# Altium project LimePSB-RPCM_1v3.PrjPcb (part 7 of 14)

## Sheet 10_USB_HDMI.SchDoc: USB and HDMI sockets
size A3; Organization: Lime Microsystems; Address1: Surrey Tech Centre; Address2: Guildford GU2 7YG; Address3: Surrey; Address4: United Kingdom; Revision: v1.3; SheetNumber: 10; SheetTotal: 15
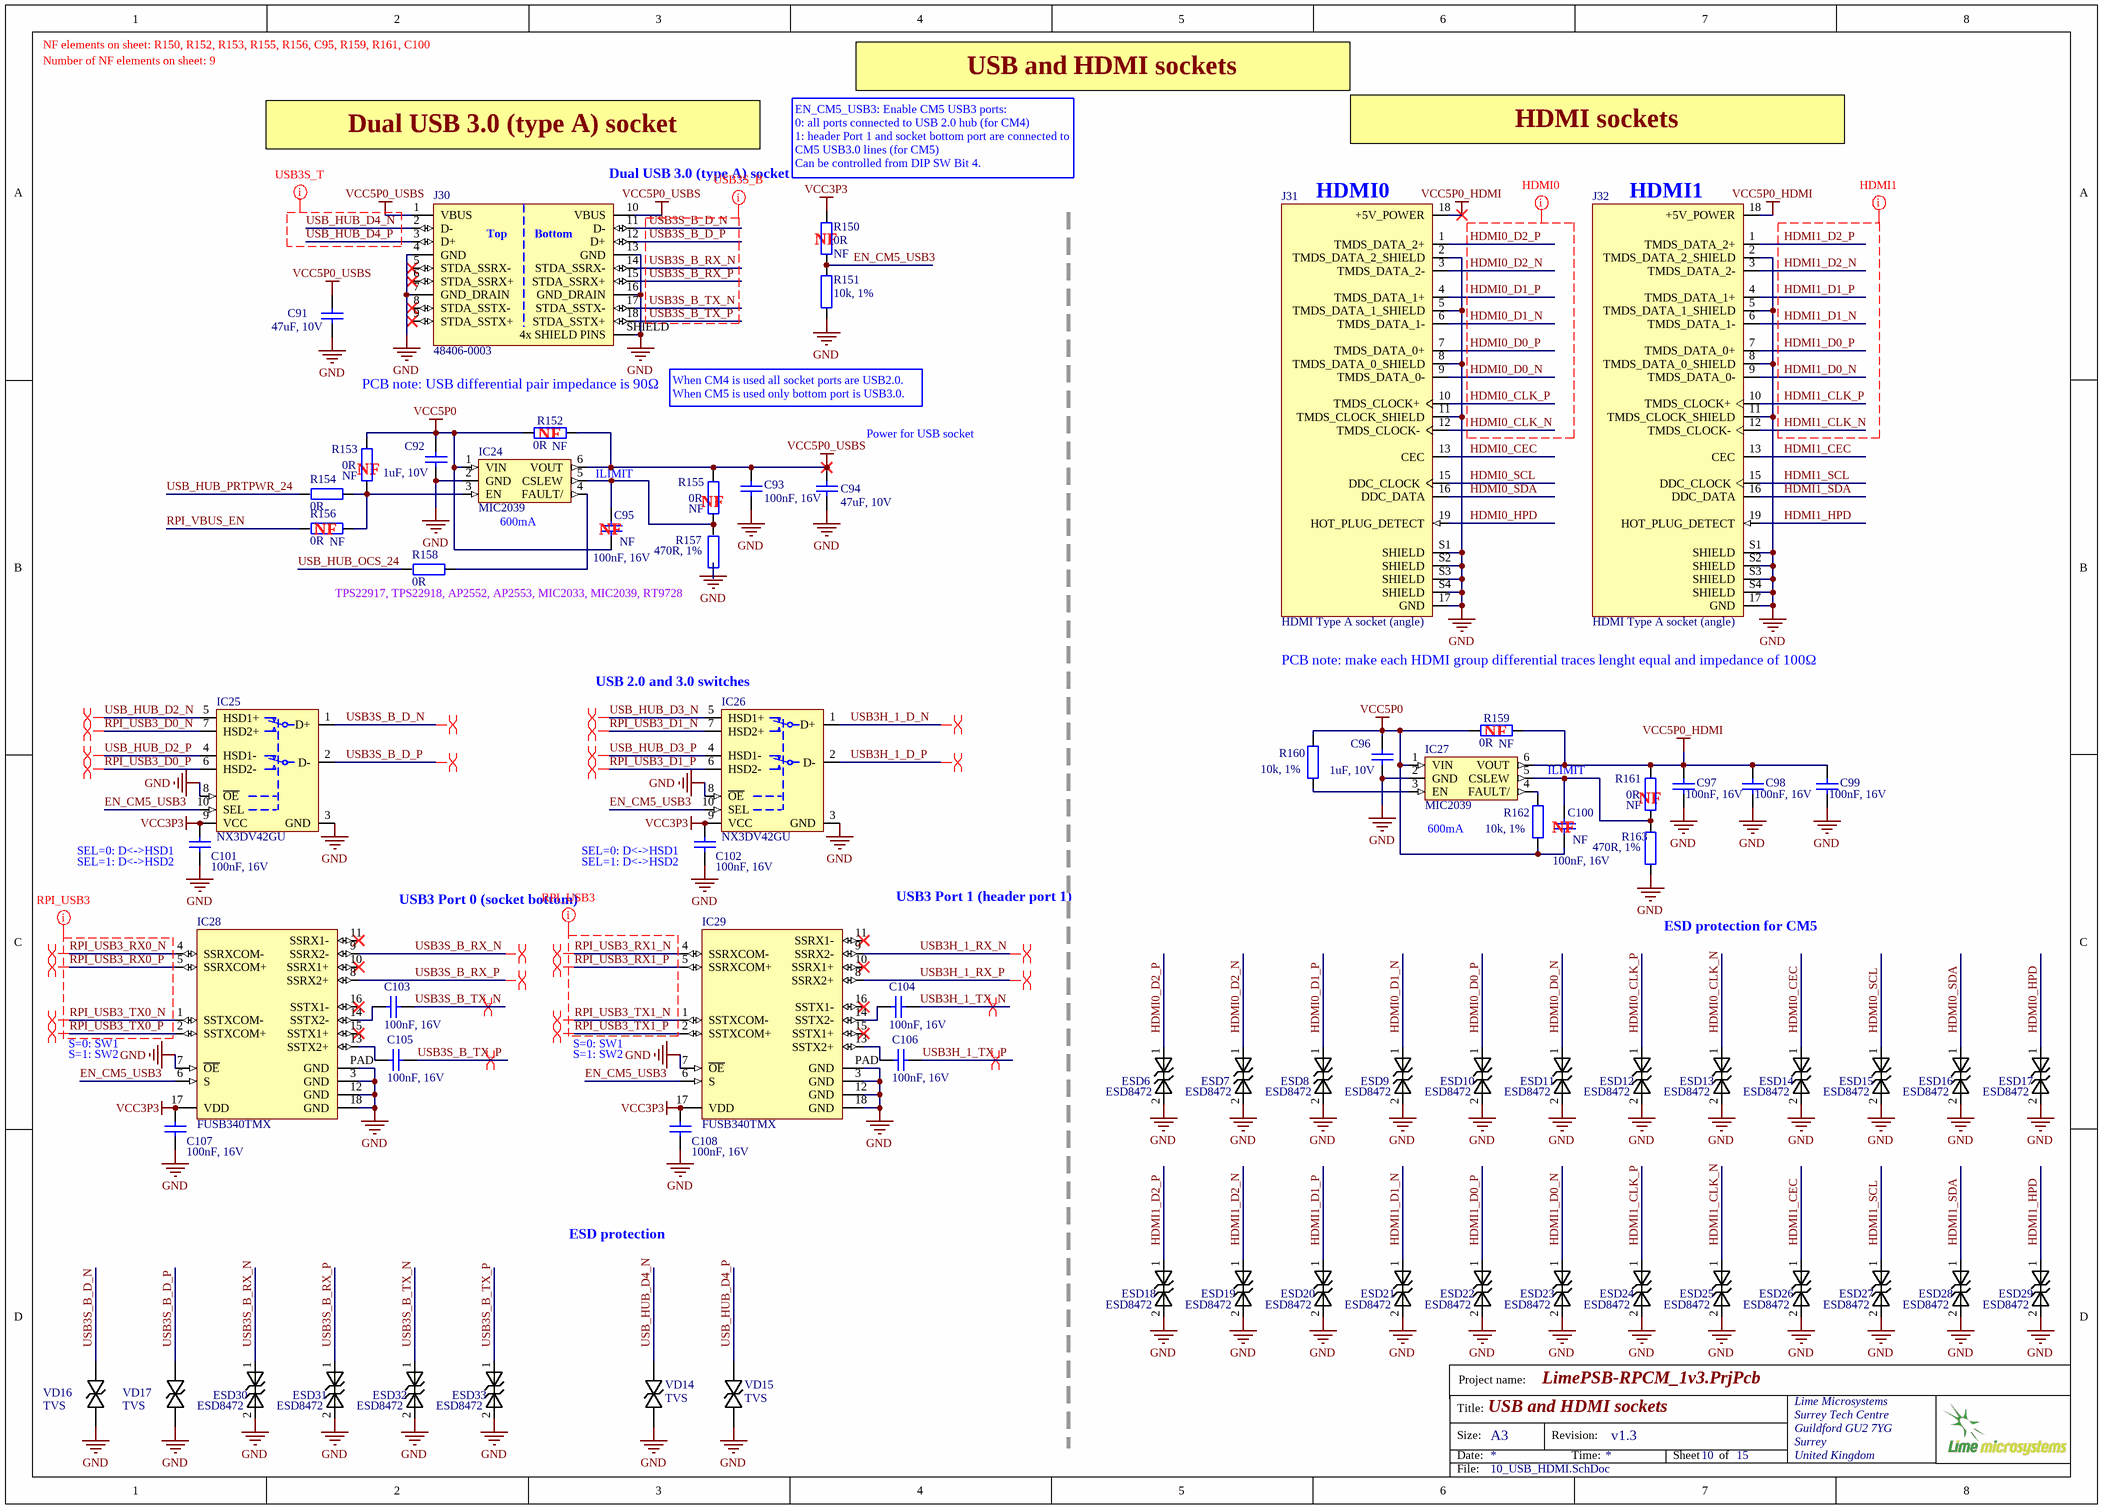
[diagram p9: 10_USB_HDMI.SchDoc]

### Parts
C91  47uF, 10V  [CAP1206]
C92  1uF, 10V  [CAP0402]
C93  100nF, 16V  [CAP0402]
C94  47uF, 10V  [CAP1206]
C95  100nF, 16V  Assembly Info: NF  [CAP0402]
C96  1uF, 10V  [CAP0402]
C97  100nF, 16V  [CAP0402]
C98  100nF, 16V  [CAP0402]
C99  100nF, 16V  [CAP0402]
C100  100nF, 16V  Assembly Info: NF  [CAP0402]
C101  100nF, 16V  [CAP0402]
C102  100nF, 16V  [CAP0402]
C103  100nF, 16V  [CAP0402]
C104  100nF, 16V  [CAP0402]
C105  100nF, 16V  [CAP0402]
C106  100nF, 16V  [CAP0402]
C107  100nF, 16V  [CAP0402]
C108  100nF, 16V  [CAP0402]
ESD6  ESD8472  [ESD8472_X3DFN2]
ESD7  ESD8472  [ESD8472_X3DFN2]
ESD8  ESD8472  [ESD8472_X3DFN2]
ESD9  ESD8472  [ESD8472_X3DFN2]
ESD10  ESD8472  [ESD8472_X3DFN2]
ESD11  ESD8472  [ESD8472_X3DFN2]
ESD12  ESD8472  [ESD8472_X3DFN2]
ESD13  ESD8472  [ESD8472_X3DFN2]
ESD14  ESD8472  [ESD8472_X3DFN2]
ESD15  ESD8472  [ESD8472_X3DFN2]
ESD16  ESD8472  [ESD8472_X3DFN2]
ESD17  ESD8472  [ESD8472_X3DFN2]
ESD18  ESD8472  [ESD8472_X3DFN2]
ESD19  ESD8472  [ESD8472_X3DFN2]
ESD20  ESD8472  [ESD8472_X3DFN2]
ESD21  ESD8472  [ESD8472_X3DFN2]
ESD22  ESD8472  [ESD8472_X3DFN2]
ESD23  ESD8472  [ESD8472_X3DFN2]
ESD24  ESD8472  [ESD8472_X3DFN2]
ESD25  ESD8472  [ESD8472_X3DFN2]
ESD26  ESD8472  [ESD8472_X3DFN2]
ESD27  ESD8472  [ESD8472_X3DFN2]
ESD28  ESD8472  [ESD8472_X3DFN2]
ESD29  ESD8472  [ESD8472_X3DFN2]
ESD30  ESD8472  [ESD8472_X3DFN2]
ESD31  ESD8472  [ESD8472_X3DFN2]
ESD32  ESD8472  [ESD8472_X3DFN2]
ESD33  ESD8472  [ESD8472_X3DFN2]
IC24  MIC2039  [SOT23-6]
IC25  NX3DV42GU  [FSUSB42UMX]
IC26  NX3DV42GU  [FSUSB42UMX]
IC27  MIC2039  [SOT23-6]
IC28  FUSB340TMX  [FUSB340TMX_USB_switch_18-XFQFN]
IC29  FUSB340TMX  [FUSB340TMX_USB_switch_18-XFQFN]
J30  48406-0003  [Dual_USB_48406-0003_Molex]
J31  HDMI Type A socket (angle)  [HDMI_HD01-19-RA-TH]
J32  HDMI Type A socket (angle)  [HDMI_HD01-19-RA-TH]
R150  0R  Assembly Info: NF  [RES0402]
R151  10k, 1%  [RES0402]
R152  0R  Assembly Info: NF  [RES0402]
R153  0R  Assembly Info: NF  [RES0402]
R154  0R  [RES0402]
R155  0R  Assembly Info: NF  [RES0402]
R156  0R  Assembly Info: NF  [RES0402]
R157  470R, 1%  [RES0402]
R158  0R  [RES0402]
R159  0R  Assembly Info: NF  [RES0402]
R160  10k, 1%  [RES0402]
R161  0R  Assembly Info: NF  [RES0402]
R162  10k, 1%  [RES0402]
R163  470R, 1%  [RES0402]
VD14  TVS  [SOD323]
VD15  TVS  [SOD323]
VD16  TVS  [SOD323]
VD17  TVS  [SOD323]

### Nets
GND: C91.1 C92.2 C93.2 C94.1 C96.2 C97.2 C98.2 C99.2 C101.2 C102.2 C107.2 C108.2 ESD6.2 ESD7.2 ESD8.2 ESD9.2 ESD10.2 ESD11.2 ESD12.2 ESD13.2 ESD14.2 ESD15.2 ESD16.2 ESD17.2 ESD18.2 ESD19.2 ESD20.2 ESD21.2 ESD22.2 ESD23.2 ESD24.2 ESD25.2 ESD26.2 ESD27.2 ESD28.2 ESD29.2 ESD30.2 ESD31.2 ESD32.2 ESD33.2 IC24.2(GND) IC25.3(GND) IC25.8(~{OE}) IC26.3(GND) IC26.8(~{OE}) IC27.2(GND) IC28.3(GND) IC28.7(~{OE}) IC28.12(GND) IC28.18(GND) IC28.PAD(GND) IC29.3(GND) IC29.7(~{OE}) IC29.12(GND) IC29.18(GND) IC29.PAD(GND) J30.4(GND) J30.7(GND_DRAIN) J30.13(GND) J30.16(GND_DRAIN) J30.SHIELD(4x_SHIELD_PINS) J31.2(TMDS_DATA_2_SHIELD) J31.5(TMDS_DATA_1_SHIELD) J31.8(TMDS_DATA_0_SHIELD) J31.11(TMDS_CLOCK_SHIELD) J31.17(GND) J31.S1(SHIELD) J31.S2(SHIELD) J31.S3(SHIELD) J31.S4(SHIELD) J32.2(TMDS_DATA_2_SHIELD) J32.5(TMDS_DATA_1_SHIELD) J32.8(TMDS_DATA_0_SHIELD) J32.11(TMDS_CLOCK_SHIELD) J32.17(GND) J32.S1(SHIELD) J32.S2(SHIELD) J32.S3(SHIELD) J32.S4(SHIELD) R151.2 R157.1 R163.1 VD14.K VD15.K VD16.K VD17.K
VCC3P3: C101.1 C102.1 C107.1 C108.1 IC25.9(VCC) IC26.9(VCC) IC28.17(VDD) IC29.17(VDD) R150.2
VCC5P0: C92.1 C95.2 C96.1 C100.2 IC24.1(VIN) IC27.1(VIN) R152.2 R153.2 R159.2 R160.2 R162.1
VCC5P0_HDMI: C97.1 C98.1 C99.1 IC27.6(VOUT) J31.18(+5V_POWER) J32.18(+5V_POWER) R159.1 R161.2
VCC5P0_USBS: C91.2 C93.1 C94.2 IC24.6(VOUT) J30.1(VBUS) J30.10(VBUS) R152.1 R155.2
EN_CM5_USB3: IC25.10(SEL) IC26.10(SEL) IC28.6(S) IC29.6(S) R150.1 R151.1
HDMI0_CEC: ESD14.1 J31.13(CEC)
HDMI0_CLK_N: ESD13.1 J31.12(TMDS_CLOCK-)
HDMI0_CLK_P: ESD12.1 J31.10(TMDS_CLOCK+)
HDMI0_D0_N: ESD11.1 J31.9(TMDS_DATA_0-)
HDMI0_D0_P: ESD10.1 J31.7(TMDS_DATA_0+)
HDMI0_D1_N: ESD9.1 J31.6(TMDS_DATA_1-)
HDMI0_D1_P: ESD8.1 J31.4(TMDS_DATA_1+)
HDMI0_D2_N: ESD7.1 J31.3(TMDS_DATA_2-)
HDMI0_D2_P: ESD6.1 J31.1(TMDS_DATA_2+)
HDMI0_HPD: ESD17.1 J31.19(HOT_PLUG_DETECT)
HDMI0_SCL: ESD15.1 J31.15(DDC_CLOCK)
HDMI0_SDA: ESD16.1 J31.16(DDC_DATA)
HDMI1_CEC: ESD26.1 J32.13(CEC)
HDMI1_CLK_N: ESD25.1 J32.12(TMDS_CLOCK-)
HDMI1_CLK_P: ESD24.1 J32.10(TMDS_CLOCK+)
HDMI1_D0_N: ESD23.1 J32.9(TMDS_DATA_0-)
HDMI1_D0_P: ESD22.1 J32.7(TMDS_DATA_0+)
HDMI1_D1_N: ESD21.1 J32.6(TMDS_DATA_1-)
HDMI1_D1_P: ESD20.1 J32.4(TMDS_DATA_1+)
HDMI1_D2_N: ESD19.1 J32.3(TMDS_DATA_2-)
HDMI1_D2_P: ESD18.1 J32.1(TMDS_DATA_2+)
HDMI1_HPD: ESD29.1 J32.19(HOT_PLUG_DETECT)
HDMI1_SCL: ESD27.1 J32.15(DDC_CLOCK)
HDMI1_SDA: ESD28.1 J32.16(DDC_DATA)
RPI_USB3_D0_N: IC25.7(HSD2+)
RPI_USB3_D0_P: IC25.6(HSD2-)
RPI_USB3_D1_N: IC26.7(HSD2+)
RPI_USB3_D1_P: IC26.6(HSD2-)
RPI_USB3_RX0_N: IC28.4(SSRXCOM-)
RPI_USB3_RX0_P: IC28.5(SSRXCOM+)
RPI_USB3_RX1_N: IC29.4(SSRXCOM-)
RPI_USB3_RX1_P: IC29.5(SSRXCOM+)
RPI_USB3_TX0_N: IC28.1(SSTXCOM-)
RPI_USB3_TX0_P: IC28.2(SSTXCOM+)
RPI_USB3_TX1_N: IC29.1(SSTXCOM-)
RPI_USB3_TX1_P: IC29.2(SSTXCOM+)
RPI_VBUS_EN: R156.2
USB3H_1_D_N: IC26.1(D+)
USB3H_1_D_P: IC26.2(D-)
USB3H_1_RX_N: IC29.9(SSRX2-)
USB3H_1_RX_P: IC29.8(SSRX2+)
USB3H_1_TX_N: C104.2
USB3H_1_TX_P: C106.2
USB3S_B_D_N: IC25.1(D+) J30.11(D-) VD16.A
USB3S_B_D_P: IC25.2(D-) J30.12(D+) VD17.A
USB3S_B_RX_N: ESD30.1 IC28.9(SSRX2-) J30.14(STDA_SSRX-)
USB3S_B_RX_P: ESD31.1 IC28.8(SSRX2+) J30.15(STDA_SSRX+)
USB3S_B_TX_N: C103.2 ESD32.1 J30.17(STDA_SSTX-)
USB3S_B_TX_P: C105.2 ESD33.1 J30.18(STDA_SSTX+)
USB_HUB_D2_N: IC25.5(HSD1+)
USB_HUB_D2_P: IC25.4(HSD1-)
USB_HUB_D3_N: IC26.5(HSD1+)
USB_HUB_D3_P: IC26.4(HSD1-)
USB_HUB_D4_N: J30.2(D-) VD14.A
USB_HUB_D4_P: J30.3(D+) VD15.A
USB_HUB_OCS_24: R158.2
USB_HUB_PRTPWR_24: R154.2
NetC95_1: C95.1 IC24.5(CSLEW) R155.1 R157.2
NetC100_1: C100.1 IC27.5(CSLEW) R161.1 R163.2
NetC103_1: C103.1 IC28.14(SSTX2-)
NetC104_1: C104.1 IC29.14(SSTX2-)
NetC105_1: C105.1 IC28.13(SSTX2+)
NetC106_1: C106.1 IC29.13(SSTX2+)
NetIC24_3: IC24.3(EN) R153.1 R154.1 R156.1
NetIC24_4: IC24.4(FAULT/) R158.1
NetIC27_3: IC27.3(EN) R160.1
NetIC27_4: IC27.4(FAULT/) R162.2

Not connected (* = marked no-connect by the designer): IC28 10(SSRX1+)* 11(SSRX1-)* 15(SSTX1+)* 16(SSTX1-)*; IC29 10(SSRX1+)* 11(SSRX1-)* 15(SSTX1+)* 16(SSTX1-)*; J30 5(STDA_SSRX-)* 6(STDA_SSRX+)* 8(STDA_SSTX-)* 9(STDA_SSTX+)*

### Layout directives
differential pair: RPI_USB3_D0_N, RPI_USB3_D0_P, RPI_USB3_D1_N, RPI_USB3_D1_P, RPI_USB3_RX0_N, RPI_USB3_RX0_P, RPI_USB3_RX1_N, RPI_USB3_RX1_P, RPI_USB3_TX0_N, RPI_USB3_TX0_P, RPI_USB3_TX1_N, RPI_USB3_TX1_P, USB3H_1_D_N, USB3H_1_D_P, USB3H_1_RX_N, USB3H_1_RX_P, USB3H_1_TX_N, USB3H_1_TX_P, USB3S_B_D_N, USB3S_B_D_P, USB3S_B_RX_N, USB3S_B_RX_P, USB3S_B_TX_N, USB3S_B_TX_P, USB_HUB_D2_N, USB_HUB_D2_P, USB_HUB_D3_N, USB_HUB_D3_P
net class RPI_USB3: RPI_USB3_RX0_N, RPI_USB3_RX0_P, RPI_USB3_RX1_N, RPI_USB3_RX1_P, RPI_USB3_TX0_N, RPI_USB3_TX0_P, RPI_USB3_TX1_N, RPI_USB3_TX1_P
net class HDMI0: HDMI0_CLK_N, HDMI0_CLK_P, HDMI0_D0_N, HDMI0_D0_P, HDMI0_D1_N, HDMI0_D1_P, HDMI0_D2_N, HDMI0_D2_P
net class HDMI1: HDMI1_CLK_N, HDMI1_CLK_P, HDMI1_D0_N, HDMI1_D0_P, HDMI1_D1_N, HDMI1_D1_P, HDMI1_D2_N, HDMI1_D2_P
net class USB3S_T: USB_HUB_D4_N, USB_HUB_D4_P, VCC5P0_USBS
net class USB3S_B: USB3S_B_D_N, USB3S_B_D_P, USB3S_B_RX_N, USB3S_B_RX_P, USB3S_B_TX_N, USB3S_B_TX_P

### Notes on the sheet
- Number of NF elements on sheet: 9
- NF elements on sheet: R150, R152, R153, R155, R156, C95, R159, R161, C100
- USB and HDMI sockets
- Dual USB 3.0 (type A) socket
- (near J30) Dual USB 3.0 (type A) socket
- (near R150) EN_CM5_USB3: Enable CM5 USB3 ports:
  0: all ports connected to USB 2.0 hub (for CM4)
  1: header Port 1 and socket bottom port are connected to CM5 USB3.0 lines (for CM5)
  Can be controlled from DIP SW Bit 4.
- HDMI sockets
- (near R150) NF
- HDMI0
- HDMI1
- PCB note: USB differential pair impedance is 90Ω
- (near R152) NF
- When CM4 is used all socket ports are USB2.0.
  When CM5 is used only bottom port is USB3.0.
- Power for USB socket
- (near R153) NF
- ILIMIT
- (near R155) NF
- (near R156) NF
- (near IC24) 600mA
- (near C95) NF
- TPS22917, TPS22918, AP2552, AP2553, MIC2033, MIC2039, RT9728
- USB 2.0 and 3.0 switches
- PCB note: make each HDMI group differential traces lenght equal and impedance of 100Ω
- (near R159) NF
- (near C101) SEL=0: D<->HSD1
- (near C102) SEL=0: D<->HSD1
- (near IC27) 600mA
- NF
- (near R161) NF
- (near C101) SEL=1: D<->HSD2
- USB3 Port 0 (socket bottom)
- (near C102) SEL=1: D<->HSD2
- USB3 Port 1 (header port 1)
- ESD protection for CM5
- S=0: SW1
- S=1: SW2
- ESD protection
- Project name:
- Title:
- Size:
- Date:
- A3
- Revision:
- Time:
- Sheet
- of
- File:

### Library data of the parts
C91 C94 = Cap_1206: Manufacturer: TDK Corporation; Manufacturer Part Number 1: C3216X6S1A476M160AC; Part Description: 47µF ±20% 10V Ceramic Capacitor X6S 1206 (3216 Metric); Notification: Current market demand for these product types have resulted in fluctuating and extending lead times. Lead times may differ.; Tolerance: ±20%; Temperature Coefficient: X6S; Value: 47uF, 10V; RoHS: RoHS Compliant; Packaging: Cut Tape (CT); Operating Temperature: -55°C ~ 105°C; Voltage - Rated: 10V; Height - Seated (Max): -; Ratings: -; Applications: General Purpose; Features: Low ESL; Size / Dimension: 0.126" L x 0.063" W (3.20mm x 1.60mm); Supplier 1: Digi-Key; Lead Spacing: -; Supplier Part Number 1: 445-6010-1-ND; Thickness (Max): 0.071" (1.80mm); Failure Rate: -; Category: Capacitors; Lead Style: -; Part Status: Active; Mounting Type: Surface Mount, MLCC; Package / Case: 1206 (3216 Metric)
C92 C96 = Cap_0402: Manufacturer Part Number 1: CC0402MRX5R6BB105; Manufacturer: Yageo; Part Description: 1µF 10V Ceramic Capacitor X5R 0402 (1005 Metric) 0.039" L x 0.020" W (1.00mm x 0.50mm); Voltage Rating: 10; Capacitance Tolerance: ± 10%; Product Range: TDK - C Series; Ceramic Capacitor Case: 0402 [1005 Metric]; Capacitance: 1; Dielectric Characteristic: X6; Value: 1uF, 10V; Supplier 1: Digi-Key; Supplier Part Number 1: 311-1732-1-ND; MSL: -; RoHS: YES
C93 C95 C97-C100 = Cap_0402: Manufacturer: Murata Electronics; Manufacturer Part Number 1: GRM155R71C104KA88D; Part Description: 0.10µF ±10% 16V Ceramic Capacitor X7R 0402 (1005 Metric); Tolerance: 10 %; Type: General Purpose MLCC; Capacitance: 0.1 uF; Case Length: 1 mm; Dielectric: X7R; Case Height: 0.5 mm; Temperature Coefficient / Code: +/- 15 %; Value: 100nF, 16V; Supplier 1: Mouser; Supplier Part Number 1: 81-GRM155R71C104KA88; Case Code - in: 0402; RoHS: RoHS Compliant; Operating Temperature Range: - 55 C to + 125 C; Series: GRM; Termination Style: SMD/SMT; Package / Case: 0402 (1005 metric); Voltage Rating DC: 16 V; Maximum Operating Temperature: + 125 C; Case Code - mm: 1005; Minimum Operating Temperature: - 55 C; Product Category: Low & Medium Capacitance SMD Ceramic Chip Capacitors; Packaging: Reel; Product: General Type MLCCs; Category: Multilayer Ceramic Capacitors MLCC - SMD/SMT; Brand: Murata Electronics; Case Width: 0.5 mm; RoHS - Mouser: Y; Standard Pack Qty: 10000; Minimum Order Quantity: 1; Reeling: True; Manufacturer Part Number: GRM155R71C104KA88D
C101-C108 = Cap_0402: Manufacturer: Murata Electronics; Manufacturer Part Number: GRM155R71C104KA88D; Part Description: 0.10µF ±10% 16V Ceramic Capacitor X7R 0402 (1005 Metric); Tolerance: 10 %; Type: General Purpose MLCC; Capacitance: 0.1 uF; Case Length: 1 mm; Dielectric: X7R; Case Height: 0.5 mm; Temperature Coefficient / Code: +/- 15 %; Value: 100nF, 16V; Supplier 1: Mouser; Supplier Part Number 1: 81-GRM155R71C104KA88; Case Code - in: 0402; RoHS: RoHS Compliant; Operating Temperature Range: - 55 C to + 125 C; Series: GRM; Termination Style: SMD/SMT; Package / Case: 0402 (1005 metric); Voltage Rating DC: 16 V; Maximum Operating Temperature: + 125 C; Case Code - mm: 1005; Minimum Operating Temperature: - 55 C; Product Category: Low & Medium Capacitance SMD Ceramic Chip Capacitors; Packaging: Reel; Product: General Type MLCCs; Category: Multilayer Ceramic Capacitors MLCC - SMD/SMT; Brand: Murata Electronics; Case Width: 0.5 mm; RoHS - Mouser: Y; Standard Pack Qty: 10000; Minimum Order Quantity: 1; Reeling: True; Manufacturer Part Number 1: GRM155R71C104KA88D
ESD6-ESD33 = ESD8472: Manufacturer: ON Semiconductor; Manufacturer Part Number 1: ESD8472MUT5G; Part Description: TVS DIODE 5.3VWM 14VC X3DFN2; Voltage - Reverse Standoff (Typ): 5.3V (Max); Voltage - Breakdown (Min): 7V; Voltage - Clamping (Max) @ Ipp: 14V; Current - Peak Pulse (10/1000µs): 3A (8/20µs); Power Line Protection: No; Capacitance @ Frequency: 0.2pF @ 1MHz; Supplier 1: Digi-Key; RoHS: RoHS Compliant; Category: Circuit Protection; Stock 1: 2295; Pricing 1: 1=0.39, 10=0.315, 100=0.2142, 500=0.16068, 1000=0.12051 (USD); Packaging: Cut Tape (CT); Part Status: Active; Type: Zener; Power - Peak Pulse: -; Applications: Automotive, RF Antenna; Operating Temperature: -55°C ~ 150°C (TJ); Mounting Type: Surface Mount; Package / Case: 2-XFDFN; Supplier Device Package: 2-X3DFN (0.62x0.32); ComponentLink1URL: http://www.onsemi.com/pub/Collateral/ESD8472-D.PDF; ComponentLink1Description: http://www.onsemi.com/pub/Collateral/ESD8472-D.PDF; Supplier Part Number 1: ESD8472MUT5GOSCT-ND
IC24 IC27 = MIC2033_power_switch: Part Description: Power Switch/Driver 1:1 P-Channel 2.5A SOT-23-6; Manufacturer: Microchip; Manufacturer Part Number 1: MIC2039EYM6-TR; Number of Outputs: 1; Interface: On/Off; Max Output Current: 2.5A; Fault Protection: Over Temperature; Output Configuration: High Side; ComponentLink1URL: http://www.mouser.com/ds/2/268/mic2033-b-1076865.pdf?src-supplier=Mouser; ComponentLink1Description: http://www.mouser.com/ds/2/268/mic2033-b-1076865.pdf?src-supplier=Mouser; ComponentLink2URL: http://components.arrow.com/part/dataview/56727820S413982N1374?src-supplier=Arrow+Electronics; ComponentLink2Description: http://components.arrow.com/part/dataview/56727820S413982N1374?src-supplier=Arrow+Electronics; ComponentLink3URL: http://www.microchip.com/mymicrochip/filehandler.aspx?ddocname=en579457&src-supplier=Digi-Key; ComponentLink3Description: http://www.microchip.com/mymicrochip/filehandler.aspx?ddocname=en579457&src-supplier=Digi-Key; Supplier 1: Digi-Key; Supplier Part Number 1: 576-4193-1-ND; Stock 1: 37195; Pricing 1: 1=0,98000, 25=0,80560, 100=0,75000 (USD); RoHS: No; Case/Package: SOT-23-6; Min Operating Temperature: -40°C; Max Operating Temperature: 125°C; Package Quantity: 3000; Packaging: Tape and Reel; Series: -; ComponentLink4URL: https://datasheet.ciiva.com/6607/mic2039-6607725.pdf?src-supplier=Digi-Key; ComponentLink4Description: https://datasheet.ciiva.com/6607/mic2039-6607725.pdf?src-supplier=Digi-Key
IC25 IC26 = FSUSB42UMX: Part Description: USB Switch IC 1 Channel 10-UMLP (1.8x1.4); Manufacturer: NXP Semiconductors; Manufacturer Part Number 1: NX3DV42GU,115; ComponentLink1URL: https://www.fairchildsemi.com/datasheets/FS/FSUSB42.pdf; ComponentLink1Description: https://www.fairchildsemi.com/datasheets/FS/FSUSB42.pdf; Supplier 1: Digikey; Supplier Part Number 1: 568-12388-1-ND; Stock 1: 3109; Pricing 1: 1=0,89, 10=0,781, 25=0,7336, 100=0,5987, 250=0,55612, 500=0,47328, 1000=0,37863 (USD); RoHS: Yes; ComponentLink2URL: http://www.mouser.com/ds/2/302/NX3DV42-1127466.pdf?src-supplier=Mouser; ComponentLink2Description: http://www.mouser.com/ds/2/302/NX3DV42-1127466.pdf?src-supplier=Mouser; ComponentLink3URL: http://www.nxp.com/documents/data_sheet/NX3DV42.pdf?src-supplier=Avnet; ComponentLink3Description: http://www.nxp.com/documents/data_sheet/NX3DV42.pdf?src-supplier=Avnet; ComponentLink4URL: http://www.nxp.com/documents/data_sheet/NX3DV42.pdf?src-supplier=Digikey; ComponentLink4Description: http://www.nxp.com/documents/data_sheet/NX3DV42.pdf?src-supplier=Digikey; ComponentLink5URL: https://www.nxp.com/docs/en/data-sheet/NX3DV42.pdf?src-supplier=Digikey; ComponentLink5Description: https://www.nxp.com/docs/en/data-sheet/NX3DV42.pdf?src-supplier=Digikey
IC28 IC29 = FUSB340TMX_USB_switch: Part Description: USB Switch USB 3.1 USB Interface 18-TMLP (2x2.8); Manufacturer: ON Semiconductor / Fairchild; Interface: USB; Operating Supply Current: 12uA; Number of Switches: 4; Data Rate: 10Gbps; Max Supply Voltage: 5V; Min Supply Voltage: 1.5V; Supplier 1: Digikey; Supplier Part Number 1: FUSB340TMXCT-ND; Manufacturer Part Number 1: FUSB340TMX; Stock 1: 7942; Pricing 1: 1=1,15, 10=1,026, 25=0,9744, 100=0,7481, 250=0,66108, 500=0,6263, 1000=0,48712, 2500=0,46277 (USD); RoHS: Yes; Mount: Surface Mount; Number of Pins: 18; Weight: 0.0065g; Min Operating Temperature: -40°C; Max Operating Temperature: 85°C; Packaging: Cut Tape; Series: -; Nominal Supply Current: 12uA; Height: 400um; RoHS Compliant: Yes; ComponentLink1URL: http://www.farnell.com/datasheets/2313412.pdf?src-supplier=Farnell; ComponentLink1Description: http://www.farnell.com/datasheets/2313412.pdf?src-supplier=Farnell; ComponentLink2URL: http://www.farnell.com/datasheets/2313412.pdf?src-supplier=Newark; ComponentLink2Description: http://www.farnell.com/datasheets/2313412.pdf?src-supplier=Newark; ComponentLink3URL: https://datasheet.octopart.com/FUSB340TMX-ON-Semiconductor-datasheet-85553255.pdf?src-supplier=Farnell; ComponentLink3Description: https://datasheet.octopart.com/FUSB340TMX-ON-Semiconductor-datasheet-85553255.pdf?src-supplier=Farnell; ComponentLink4URL: https://datasheet.octopart.com/FUSB340TMX-ON-Semiconductor-datasheet-46935021.pdf?src-supplier=Future+Electronics; ComponentLink4Description: https://datasheet.octopart.com/FUSB340TMX-ON-Semiconductor-datasheet-46935021.pdf?src-supplier=Future+Electronics; ComponentLink5URL: https://www.fairchildsemi.com/Assets/-Featured-Collateral/Datasheet-Briefs/FUSB340_PB_Final.pdf?src-supplier=Avnet; ComponentLink5Description: https://www.fairchildsemi.com/Assets/-Featured-Collateral/Datasheet-Briefs/FUSB340_PB_Final.pdf?src-supplier=Avnet
J30 = Dual_USB_48406-0003_Molex: Part Description: USB Connectors USB 3.0 F/A STD RA REC STACKED 15u'; Manufacturer: Molex; Manufacturer Part Number 1: 0484060003; Supplier 1: Mouser; Supplier Part Number 1: 538-48406-0003; Stock 1: 4086; Pricing 1: 1=2,69, 10=1,92, 50=1,92, 100=1,82, 1000=1,78, 10000=1,43 (USD); RoHS: Yes; ComponentLink1URL: https://datasheet.octopart.com/48406-0003-Molex-datasheet-33003502.pdf?src-supplier=Newark; ComponentLink1Description: https://datasheet.octopart.com/48406-0003-Molex-datasheet-33003502.pdf?src-supplier=Newark; ComponentLink2URL: https://datasheet.octopart.com/48406-0003-Molex-datasheet-101583044.pdf?src-supplier=Farnell; ComponentLink2Description: https://datasheet.octopart.com/48406-0003-Molex-datasheet-101583044.pdf?src-supplier=Farnell; ComponentLink3URL: https://www.molex.com/pdm_docs/sd/484060003_sd.pdf?src-supplier=Digikey; ComponentLink3Description: https://www.molex.com/pdm_docs/sd/484060003_sd.pdf?src-supplier=Digikey; ComponentLink4URL: https://datasheet.octopart.com/484060003-Molex-datasheet-168216735.pdf?src-supplier=TME; ComponentLink4Description: https://datasheet.octopart.com/484060003-Molex-datasheet-168216735.pdf?src-supplier=TME; ComponentLink5URL: https://datasheet.octopart.com/48406-0003-Molex-datasheet-21137617.pdf?src-supplier=Sager+Electronics; ComponentLink5Description: https://datasheet.octopart.com/48406-0003-Molex-datasheet-21137617.pdf?src-supplier=Sager+Electronics; ComponentLink6URL: https://datasheet.octopart.com/48406-0003-Molex-datasheet-154752298.pdf?src-supplier=Master+Electronics; ComponentLink6Description: https://datasheet.octopart.com/48406-0003-Molex-datasheet-154752298.pdf?src-supplier=Master+Electronics
J31 J32 = HDMI_HD01-19-RA-TH: Manufacturer: CUI Devices; Part Description: HDMI HDMI 2.1 Receptacle Connector 19 Position Through Hole, Right Angle; Supplier 1: Digi-Key; Supplier Part Number 1: 2223-HD01-19-RA-TH-ND; Manufacturer Part Number 1: HD01-19-RA-TH; Stock 1: 2182; Pricing 1: 1=2,15000, 10=1,87000, 25=1,79080, 70=1,75100, 140=1,67136, 280=1,51221, 490=1,39282, 980=1,19385, 2450=1,11426 (USD); RoHS: No
R150 R152-R156 R158 R159 R161 = Res_0402: Manufacturer Part Number 1: RC0402JR-070RL; Manufacturer: Yageo; Part Description: RES SMD 0.0OHM JUMPER 1/16W 0402; Resistance (Ohms): 0.0; Tolerance: Jumper; Power (Watts): 0.063W, 1/16W; Value: 0R; Supplier 1: Digi-Key; Supplier Part Number 1: 311-0.0JRTR-ND; Category: Resistors; Temperature Coefficient: -; Features: Moisture Resistant; Supplier Device Package: 0402; Height: 0.016" (0.40mm); Package / Case: 0402 (1005 Metric); Operating Temperature: -55°C ~ 155°C; Size / Dimension: 0.039" L x 0.020" W (1.00mm x 0.50mm); Composition: Thick Film; Packaging: Tape & Reel (TR); Number of Terminations: 2; RoHS: RoHS Compliant
R151 R160 R162 = Res_0402: Manufacturer: Yageo; Manufacturer Part Number 1: RC0402FR-0710KL; Part Description: RES SMD 10K OHM 1% 1/16W 0402; Temperature Coefficient: ±100ppm/°C; Power (Watts): 0.063W, 1/16W; Value: 10k, 1%; Supplier 1: Digi-Key; Supplier Part Number 1: 311-10.0KLRTR-ND; Resistance (Ohms): 10k; Packaging: Tape & Reel (TR); RoHS: RoHS Compliant; Package / Case: 0402 (1005 Metric); Tolerance: ±1%; Operating Temperature: -55°C ~ 155°C; Size / Dimension: 0.039" L x 0.020" W (1.00mm x 0.50mm); Number of Terminations: 2; Category: Resistors; Height: 0.016" (0.40mm); Supplier Device Package: 0402; Features: Moisture Resistant; Composition: Thick Film
R157 R163 = Res_0402: Manufacturer 1: Yageo; Manufacturer Part Number 1: RC0402FR-07470RL; Part Description: 470 Ohms ±1% 0.063W, 1/16W Chip Resistor 0402 (1005 Metric) Moisture Resistant Thick Film; Power Rating: 62.5mW; Temperature Coefficient: 100ppm/°C; Voltage Rating: 50V; Max Power Dissipation: 63mW; Value: 470R, 1%; Supplier 1: Digi-Key; Supplier Part Number 1: 311-470LRCT-ND; Stock 1: 1652476; Pricing 1: 1=0,10000, 10=0,01600, 100=0,00660, 1000=0,00299, 2500=0,00259, 5000=0,00214 (USD); RoHS: Yes; Case/Package: 0402; Case Code (Metric): 1005; Case Code (Imperial): 0402; Size Code: 0402; Min Operating Temperature: -55°C; Max Operating Temperature: 155°C; Packaging: Tape and Reel; Tolerance: 1%; Resistance: 470R; Number of Terminations: 2; Features: Moisture Resistant; Package Quantity: 1; Resistor Type: Thick Film; Termination: SMD/SMT; Series: RC; Resistance Tolerance: 1%; Construction: Rectangular; Length: 1mm; Width: 0.02inch; Height: 0.016inch; Depth: 0.5mm; Lead Free: Lead Free; REACH SVHC: Unknown; Military Standard: Not; RoHS Compliant: Yes; Manufacturer: Yageo
VD14-VD17 = DIODE_TVS: Manufacturer 1: Sangdest Microelectronics; Manufacturer Part Number: SD03LCC; Part Description: 19V Clamp 20A (8/20µs) Ipp Tvs Diode Surface Mount SOD-323; ComponentLink1URL: https://datasheet.ciiva.com/29588/littelfuse-tvs-diode-array-sp4020-datasheet-pdf-29588193.pdf?src-supplier=Digi-Key; ComponentLink1Description: https://datasheet.ciiva.com/29588/littelfuse-tvs-diode-array-sp4020-datasheet-pdf-29588193.pdf?src-supplier=Digi-Key; ComponentLink2URL: https://datasheet.ciiva.com/24111/littelfuse-sp4020-267385-24111169.pdf?src-supplier=Mouser; ComponentLink2Description: https://datasheet.ciiva.com/24111/littelfuse-sp4020-267385-24111169.pdf?src-supplier=Mouser; Supplier 1: Digi-Key; Supplier Part Number 1: 1655-SD03LCCCT-ND; Stock 1: 8808; Pricing 1: 1=0,37000, 10=0,27300, 100=0,15460, 500=0,10240, 1000=0,07851 (USD); RoHS: No; Manufacturer: Sangdest Microelectronics; Manufacturer Part Number 1: SD03LCC